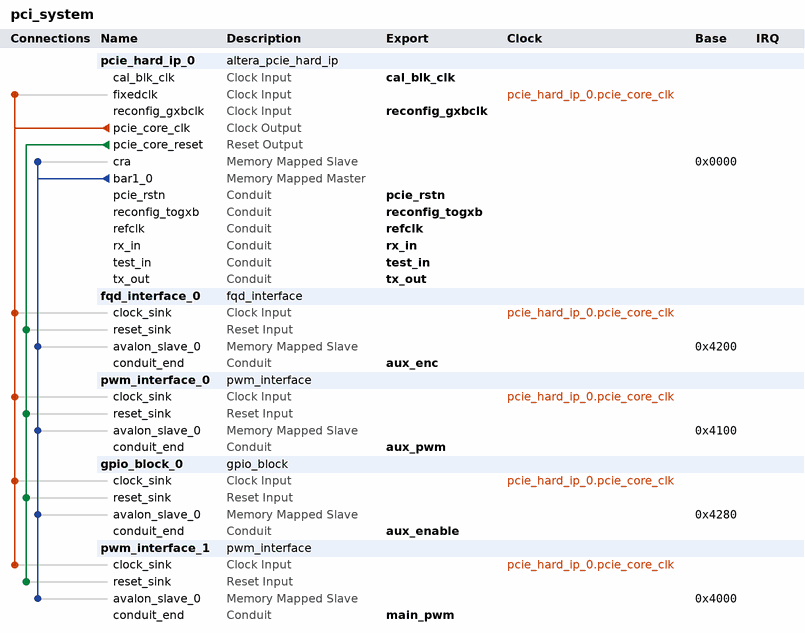
[diagram p0: system contents]
# Platform Designer (Qsys) system pci_system, Cyclone IV GX EP4CGX30CF19C8
# Parameters at their usual value, and those the tool derives, are not listed.
package require -exact qsys 13.0
create_system pci_system
set_project_property DEVICE_FAMILY {Cyclone IV GX}
set_project_property DEVICE EP4CGX30CF19C8

add_instance pcie_hard_ip_0 altera_pcie_hard_ip 13.0
set_instance_parameter_value pcie_hard_ip_0 p_pcie_test_out_width None
set_instance_parameter_value pcie_hard_ip_0 {BAR Type} {64 bit Prefetchable,Not used,32 bit Non-Prefetchable,Not used,Not used,Not used}
set_instance_parameter_value pcie_hard_ip_0 vendor_id 4466
set_instance_parameter_value pcie_hard_ip_0 device_id 4
set_instance_parameter_value pcie_hard_ip_0 class_code 0
set_instance_parameter_value pcie_hard_ip_0 subsystem_vendor_id 4466
set_instance_parameter_value pcie_hard_ip_0 subsystem_device_id 4
set_instance_parameter_value pcie_hard_ip_0 my_advanced_errors false
set_instance_parameter_value pcie_hard_ip_0 my_enable_ecrc_check false
set_instance_parameter_value pcie_hard_ip_0 my_enable_ecrc_gen false
set_instance_parameter_value pcie_hard_ip_0 p_pcie_target_performance_preset Low
set_instance_parameter_value pcie_hard_ip_0 CB_PCIE_MODE 1
set_instance_parameter_value pcie_hard_ip_0 CG_NO_CPL_REORDERING 0
set_instance_parameter_value pcie_hard_ip_0 CG_ENABLE_A2P_INTERRUPT 0
set_instance_parameter_value pcie_hard_ip_0 CB_A2P_ADDR_MAP_PASS_THRU_BITS 20
set_instance_parameter_value pcie_hard_ip_0 {PCIe Address 63:32} 0x00000000,0x00000000,0x00000000,0x00000000,0x00000000,0x00000000,0x00000000,0x00000000,0x00000000,0x00000000,0x00000000,0x00000000,0x00000000,0x00000000,0x00000000,0x00000000
set_instance_parameter_value pcie_hard_ip_0 {PCIe Address 31:0} 0x00000000,0x00000000,0x00000000,0x00000000,0x00000000,0x00000000,0x00000000,0x00000000,0x00000000,0x00000000,0x00000000,0x00000000,0x00000000,0x00000000,0x00000000,0x00000000

add_instance fqd_interface_0 fqd_interface 0.1.1
set_instance_parameter_value fqd_interface_0 number_of_fqds 6

add_instance pwm_interface_0 pwm_interface 0.1.1
set_instance_parameter_value pwm_interface_0 number_of_pwms 6

add_instance gpio_block_0 gpio_block 0.1.1
set_instance_parameter_value gpio_block_0 number_of_gpios 6

add_instance pwm_interface_1 pwm_interface 0.1.1
set_instance_parameter_value pwm_interface_1 number_of_pwms 3

# connections
add_connection pcie_hard_ip_0.pcie_core_clk fqd_interface_0.clock_sink clock
add_connection pcie_hard_ip_0.pcie_core_clk gpio_block_0.clock_sink clock
add_connection pcie_hard_ip_0.pcie_core_clk pcie_hard_ip_0.fixedclk clock
add_connection pcie_hard_ip_0.pcie_core_clk pwm_interface_0.clock_sink clock
add_connection pcie_hard_ip_0.pcie_core_clk pwm_interface_1.clock_sink clock
add_connection pcie_hard_ip_0.pcie_core_reset fqd_interface_0.reset_sink reset
add_connection pcie_hard_ip_0.pcie_core_reset gpio_block_0.reset_sink reset
add_connection pcie_hard_ip_0.pcie_core_reset pwm_interface_0.reset_sink reset
add_connection pcie_hard_ip_0.pcie_core_reset pwm_interface_1.reset_sink reset
add_connection pcie_hard_ip_0.bar1_0 fqd_interface_0.avalon_slave_0 avalon
set_connection_parameter_value pcie_hard_ip_0.bar1_0/fqd_interface_0.avalon_slave_0 baseAddress 0x4200
add_connection pcie_hard_ip_0.bar1_0 gpio_block_0.avalon_slave_0 avalon
set_connection_parameter_value pcie_hard_ip_0.bar1_0/gpio_block_0.avalon_slave_0 baseAddress 0x4280
add_connection pcie_hard_ip_0.bar1_0 pcie_hard_ip_0.cra avalon
set_connection_parameter_value pcie_hard_ip_0.bar1_0/pcie_hard_ip_0.cra baseAddress 0x0000
add_connection pcie_hard_ip_0.bar1_0 pwm_interface_0.avalon_slave_0 avalon
set_connection_parameter_value pcie_hard_ip_0.bar1_0/pwm_interface_0.avalon_slave_0 baseAddress 0x4100
add_connection pcie_hard_ip_0.bar1_0 pwm_interface_1.avalon_slave_0 avalon
set_connection_parameter_value pcie_hard_ip_0.bar1_0/pwm_interface_1.avalon_slave_0 baseAddress 0x4000

# exported interfaces
add_interface cal_blk_clk clock sink
set_interface_property cal_blk_clk EXPORT_OF pcie_hard_ip_0.cal_blk_clk
add_interface test_in conduit end
set_interface_property test_in EXPORT_OF pcie_hard_ip_0.test_in
add_interface refclk conduit end
set_interface_property refclk EXPORT_OF pcie_hard_ip_0.refclk
add_interface pcie_rstn conduit end
set_interface_property pcie_rstn EXPORT_OF pcie_hard_ip_0.pcie_rstn
add_interface rx_in conduit end
set_interface_property rx_in EXPORT_OF pcie_hard_ip_0.rx_in
add_interface tx_out conduit end
set_interface_property tx_out EXPORT_OF pcie_hard_ip_0.tx_out
add_interface reconfig_togxb conduit end
set_interface_property reconfig_togxb EXPORT_OF pcie_hard_ip_0.reconfig_togxb
add_interface reconfig_gxbclk clock sink
set_interface_property reconfig_gxbclk EXPORT_OF pcie_hard_ip_0.reconfig_gxbclk
add_interface aux_enc conduit end
set_interface_property aux_enc EXPORT_OF fqd_interface_0.conduit_end
add_interface aux_pwm conduit end
set_interface_property aux_pwm EXPORT_OF pwm_interface_0.conduit_end
add_interface aux_enable conduit end
set_interface_property aux_enable EXPORT_OF gpio_block_0.conduit_end
add_interface main_pwm conduit end
set_interface_property main_pwm EXPORT_OF pwm_interface_1.conduit_end

set_interconnect_requirement {$system} qsys_mm.clockCrossingAdapter HANDSHAKE
set_interconnect_requirement {$system} qsys_mm.maxAdditionalLatency 1

save_system pci_system.qsys
